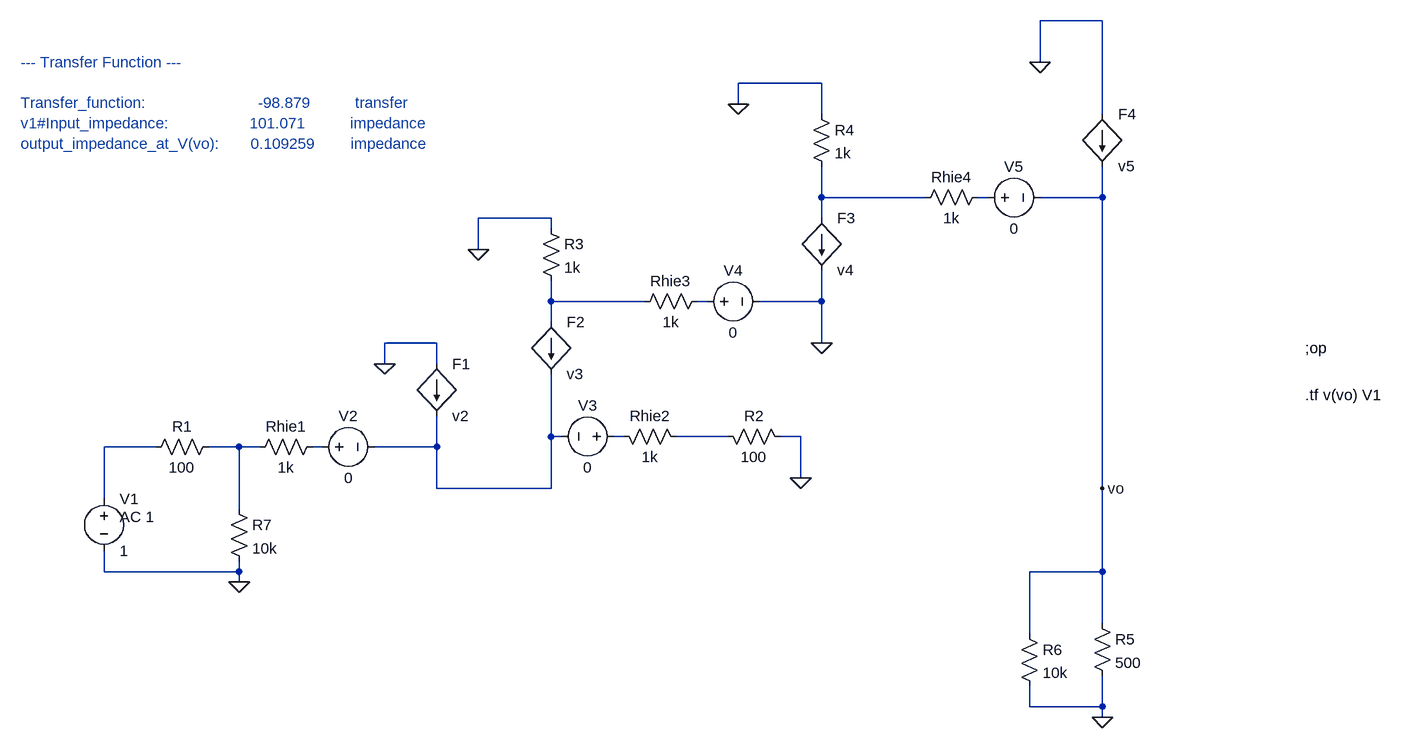
[diagram p0: schematic g1_10 - copia.asc]
g1_10 - copia.asc, the LTspice schematic file:
Version 4.1
SHEET 1 1064 680
WIRE -192 -816 -288 -816
WIRE -288 -752 -288 -816
WIRE -624 -720 -752 -720
WIRE -752 -688 -752 -720
WIRE -624 -672 -624 -720
WIRE -192 -672 -192 -816
WIRE -624 -544 -624 -592
WIRE -464 -544 -624 -544
WIRE -368 -544 -384 -544
WIRE -192 -544 -192 -592
WIRE -192 -544 -288 -544
WIRE -1040 -512 -1152 -512
WIRE -624 -512 -624 -544
WIRE -1040 -496 -1040 -512
WIRE -1152 -464 -1152 -512
WIRE -1040 -384 -1040 -416
WIRE -896 -384 -1040 -384
WIRE -800 -384 -816 -384
WIRE -624 -384 -624 -432
WIRE -624 -384 -720 -384
WIRE -1040 -352 -1040 -384
WIRE -1216 -320 -1296 -320
WIRE -624 -320 -624 -384
WIRE -1296 -288 -1296 -320
WIRE -1216 -288 -1216 -320
WIRE -1040 -176 -1040 -272
WIRE -1024 -176 -1040 -176
WIRE -928 -176 -944 -176
WIRE -768 -176 -848 -176
WIRE -656 -176 -688 -176
WIRE -1648 -160 -1728 -160
WIRE -1520 -160 -1568 -160
WIRE -1488 -160 -1520 -160
WIRE -1392 -160 -1408 -160
WIRE -1216 -160 -1216 -208
WIRE -1216 -160 -1312 -160
WIRE -656 -112 -656 -176
WIRE -1216 -96 -1216 -160
WIRE -1040 -96 -1040 -176
WIRE -1040 -96 -1216 -96
WIRE -192 -96 -192 -544
WIRE -1728 -80 -1728 -160
WIRE -1520 -64 -1520 -160
WIRE -1728 32 -1728 0
WIRE -1520 32 -1520 16
WIRE -1520 32 -1728 32
WIRE -192 32 -192 -96
WIRE -192 32 -304 32
WIRE -1520 48 -1520 32
WIRE -192 112 -192 32
WIRE -304 128 -304 32
WIRE -304 240 -304 208
WIRE -192 240 -192 192
WIRE -192 240 -304 240
WIRE -192 256 -192 240
FLAG -1296 -288 0
FLAG -656 -112 0
FLAG -1152 -464 0
FLAG -752 -688 0
FLAG -624 -320 0
FLAG -288 -752 0
FLAG -192 256 0
FLAG -192 -96 vo
FLAG -1520 48 0
SYMBOL res -1552 -176 R90
WINDOW 0 0 56 VBottom 2
WINDOW 3 32 56 VTop 2
SYMATTR InstName R1
SYMATTR Value 100
SYMBOL res -1392 -176 R90
WINDOW 0 0 56 VBottom 2
WINDOW 3 32 56 VTop 2
SYMATTR InstName Rhie1
SYMATTR Value 1k
SYMBOL f -1216 -288 R0
SYMATTR InstName F1
SYMATTR Value v2
SYMATTR Value2 200
SYMBOL voltage -1408 -160 R270
WINDOW 0 32 56 VTop 2
WINDOW 3 -32 56 VBottom 2
WINDOW 123 0 0 Left 2
WINDOW 39 0 0 Left 2
SYMATTR InstName V2
SYMATTR Value 0
SYMBOL res -784 -192 M90
WINDOW 0 0 56 VBottom 2
WINDOW 3 32 56 VTop 2
SYMATTR InstName R2
SYMATTR Value 100
SYMBOL res -944 -192 M90
WINDOW 0 0 56 VBottom 2
WINDOW 3 32 56 VTop 2
SYMATTR InstName Rhie2
SYMATTR Value 1k
SYMBOL voltage -928 -176 M270
WINDOW 0 32 56 VTop 2
WINDOW 3 -32 56 VBottom 2
WINDOW 123 0 0 Left 2
WINDOW 39 0 0 Left 2
SYMATTR InstName V3
SYMATTR Value 0
SYMBOL f -1040 -352 R0
SYMATTR InstName F2
SYMATTR Value v3
SYMATTR Value2 200
SYMBOL res -1056 -512 R0
SYMATTR InstName R3
SYMATTR Value 1k
SYMBOL res -800 -400 R90
WINDOW 0 0 56 VBottom 2
WINDOW 3 32 56 VTop 2
SYMATTR InstName Rhie3
SYMATTR Value 1k
SYMBOL f -624 -512 R0
SYMATTR InstName F3
SYMATTR Value v4
SYMATTR Value2 200
SYMBOL voltage -816 -384 R270
WINDOW 0 32 56 VTop 2
WINDOW 3 -32 56 VBottom 2
WINDOW 123 0 0 Left 2
WINDOW 39 0 0 Left 2
SYMATTR InstName V4
SYMATTR Value 0
SYMBOL res -640 -688 R0
SYMATTR InstName R4
SYMATTR Value 1k
SYMBOL res -368 -560 R90
WINDOW 0 0 56 VBottom 2
WINDOW 3 32 56 VTop 2
SYMATTR InstName Rhie4
SYMATTR Value 1k
SYMBOL f -192 -672 R0
SYMATTR InstName F4
SYMATTR Value v5
SYMATTR Value2 200
SYMBOL voltage -384 -544 R270
WINDOW 0 32 56 VTop 2
WINDOW 3 -32 56 VBottom 2
WINDOW 123 0 0 Left 2
WINDOW 39 0 0 Left 2
SYMATTR InstName V5
SYMATTR Value 0
SYMBOL res -208 96 R0
SYMATTR InstName R5
SYMATTR Value 500
SYMBOL res -320 112 R0
SYMATTR InstName R6
SYMATTR Value 10k
SYMBOL res -1536 -80 R0
SYMATTR InstName R7
SYMATTR Value 10k
SYMBOL voltage -1728 -96 R0
WINDOW 123 24 44 Left 2
WINDOW 39 0 0 Left 0
SYMATTR InstName V1
SYMATTR Value 1
SYMATTR Value2 AC 1
TEXT 120 -312 Left 2 !;op
TEXT 120 -240 Left 2 !.tf v(vo) V1
TEXT -1856 -752 Left 2 ;--- Transfer Function ---\n \nTransfer_function:                         -98.879          transfer\nv1#Input_impedance:                  101.071          impedance\noutput_impedance_at_V(vo):       0.109259        impedance

The netlist it stands for:
* g1_10 - copia.asc
R1 N009 N008 100
Rhie1 N010 N009 1k
F1 0 N005 v2 200
V2 N010 N005 0
R2 N007 0 100
Rhie2 N006 N007 1k
V3 N006 N005 0
F2 N003 N005 v3 200
R3 0 N003 1k
Rhie3 N004 N003 1k
F3 N001 0 v4 200
V4 N004 0 0
R4 0 N001 1k
Rhie4 N002 N001 1k
F4 0 vo v5 200
V5 N002 vo 0
R5 vo 0 500
R6 vo 0 10k
R7 N009 0 10k
V1 N008 0 1 AC 1
;op
.tf v(vo) V1
* --- Transfer Function ---
* Transfer_function:                         -98.879          transfer
* v1#Input_impedance:                  101.071          impedance
* output_impedance_at_V(vo):       0.109259        impedance
.backanno
.end